# EAGLE design UP-4_v9 (EAGLE 6.4)
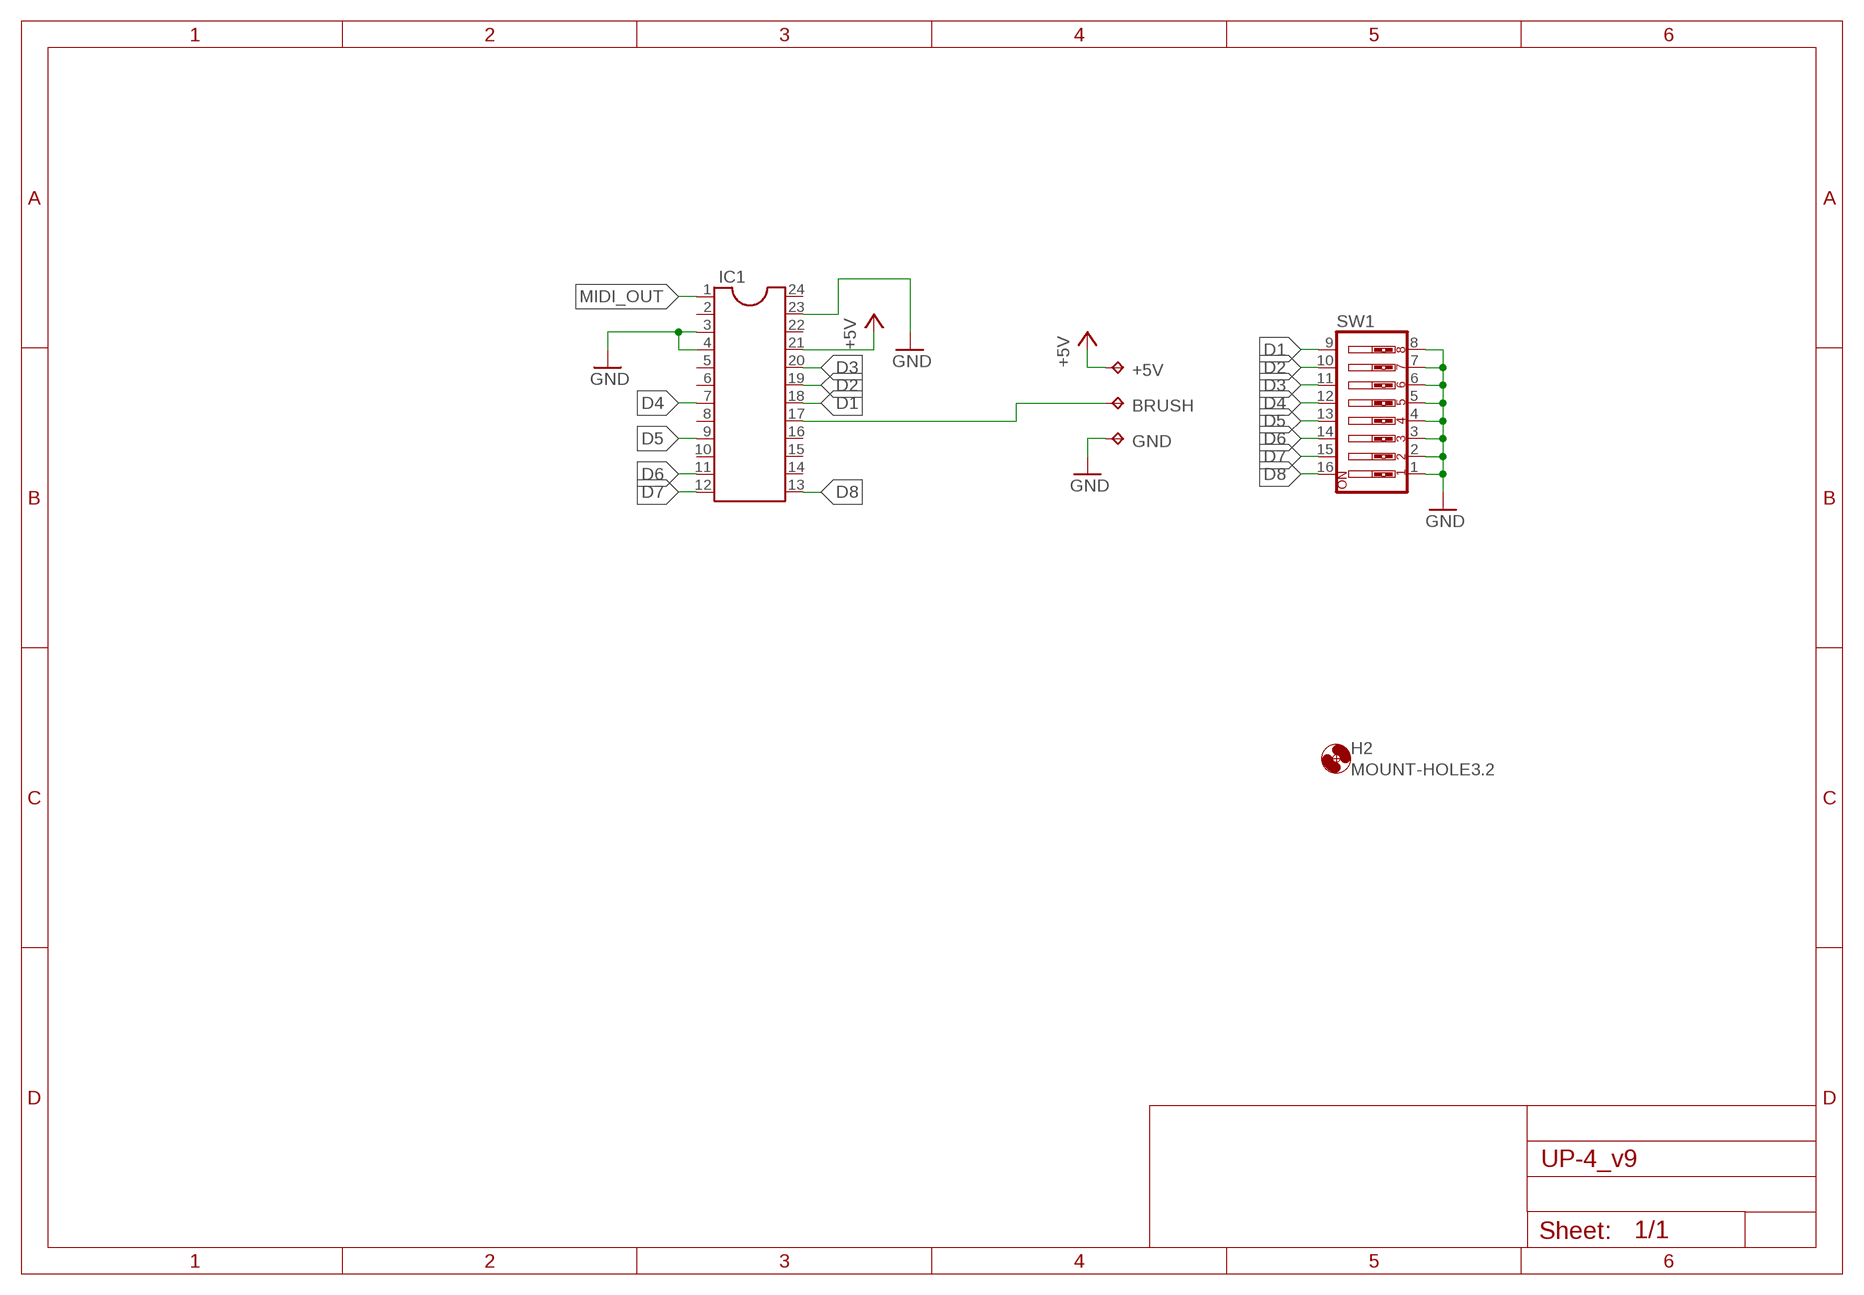
[diagram p0: schematic, sheet 1]

## Parts
+5V  TPB2,54  [B2,54]
BRUSH  TPB2,54  [B2,54]
GND  TPB2,54  [B2,54]
H2  MOUNT-HOLE3.2  [3,2]
IC1  DIL24-6  [DIL24-6]
SW1  SW_DIP-8  [EDG-08]

## Nets
+5V: +5V.TP IC1.21
BRUSH: BRUSH.TP IC1.17
D1: IC1.18 SW1.9
D2: IC1.19 SW1.10
D3: IC1.20 SW1.11
D4: IC1.7 SW1.12
D5: IC1.9 SW1.13
D6: IC1.11 SW1.14
D7: IC1.12 SW1.15
D8: IC1.13 SW1.16
GND: GND.TP IC1.3 IC1.4 IC1.23 SW1.1 SW1.2 SW1.3 SW1.4 SW1.5 SW1.6 SW1.7 SW1.8
MIDI_OUT: IC1.1
Unconnected: IC1.2 IC1.5 IC1.6 IC1.8 IC1.10 IC1.14 IC1.15 IC1.16 IC1.22 IC1.24

## Library data of the parts
+5V BRUSH GND = testpad:TP: Test pad
H2 = holes:MOUNT-HOLE: MOUNTING HOLE with drill center marker
IC1 = ic-package:DIL24: Dual In Line
SW1 = special:SW_DIP-8: DIP SWITCH

## Board
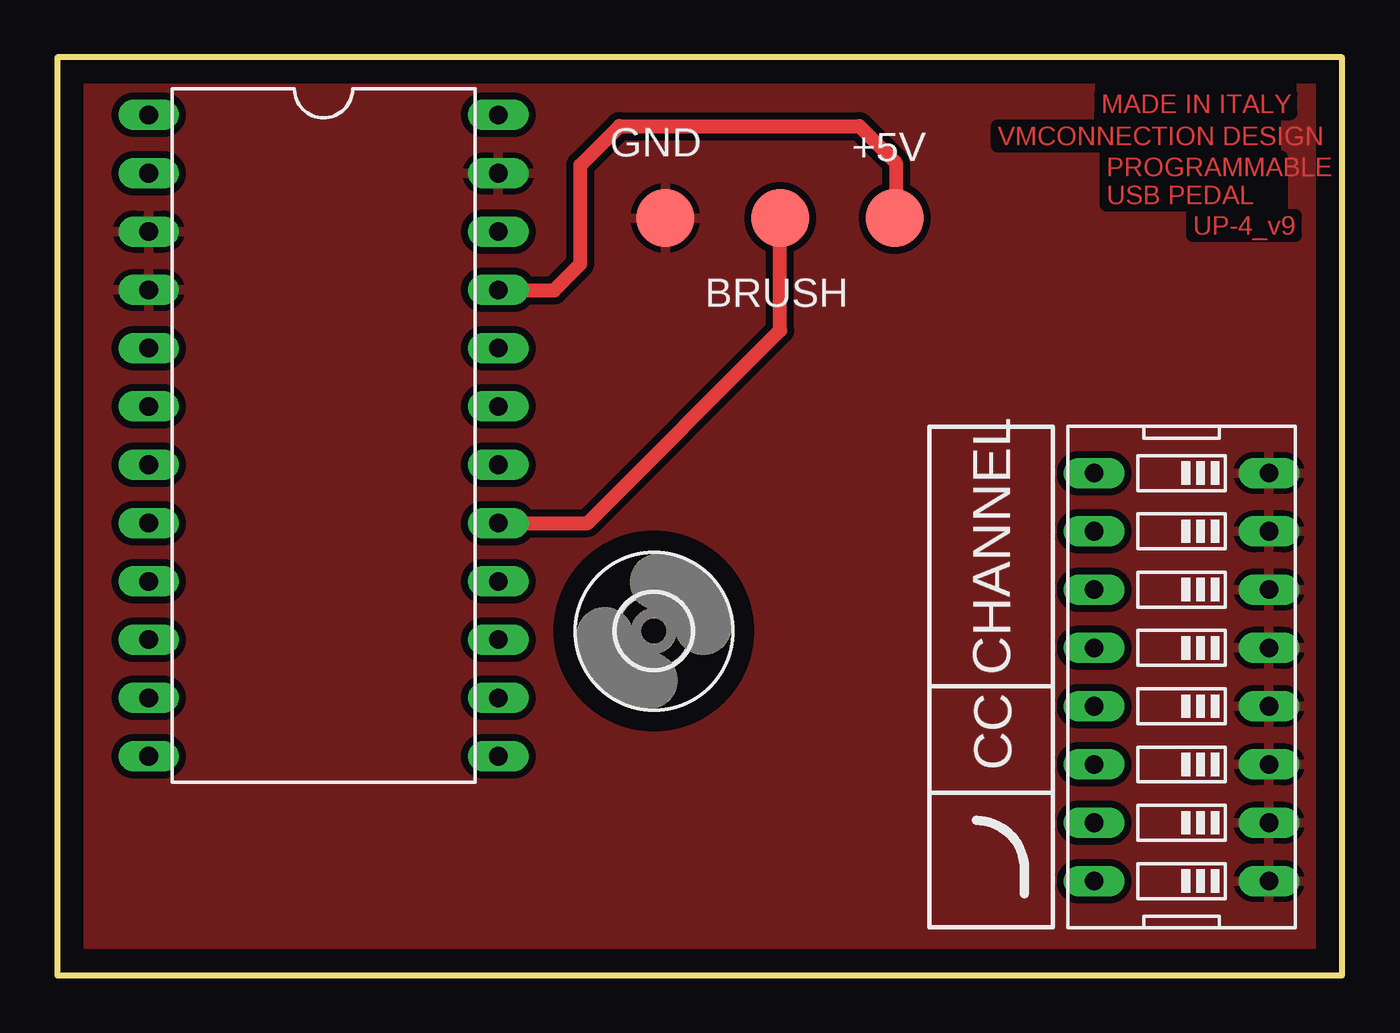
[diagram p1: board, top side]
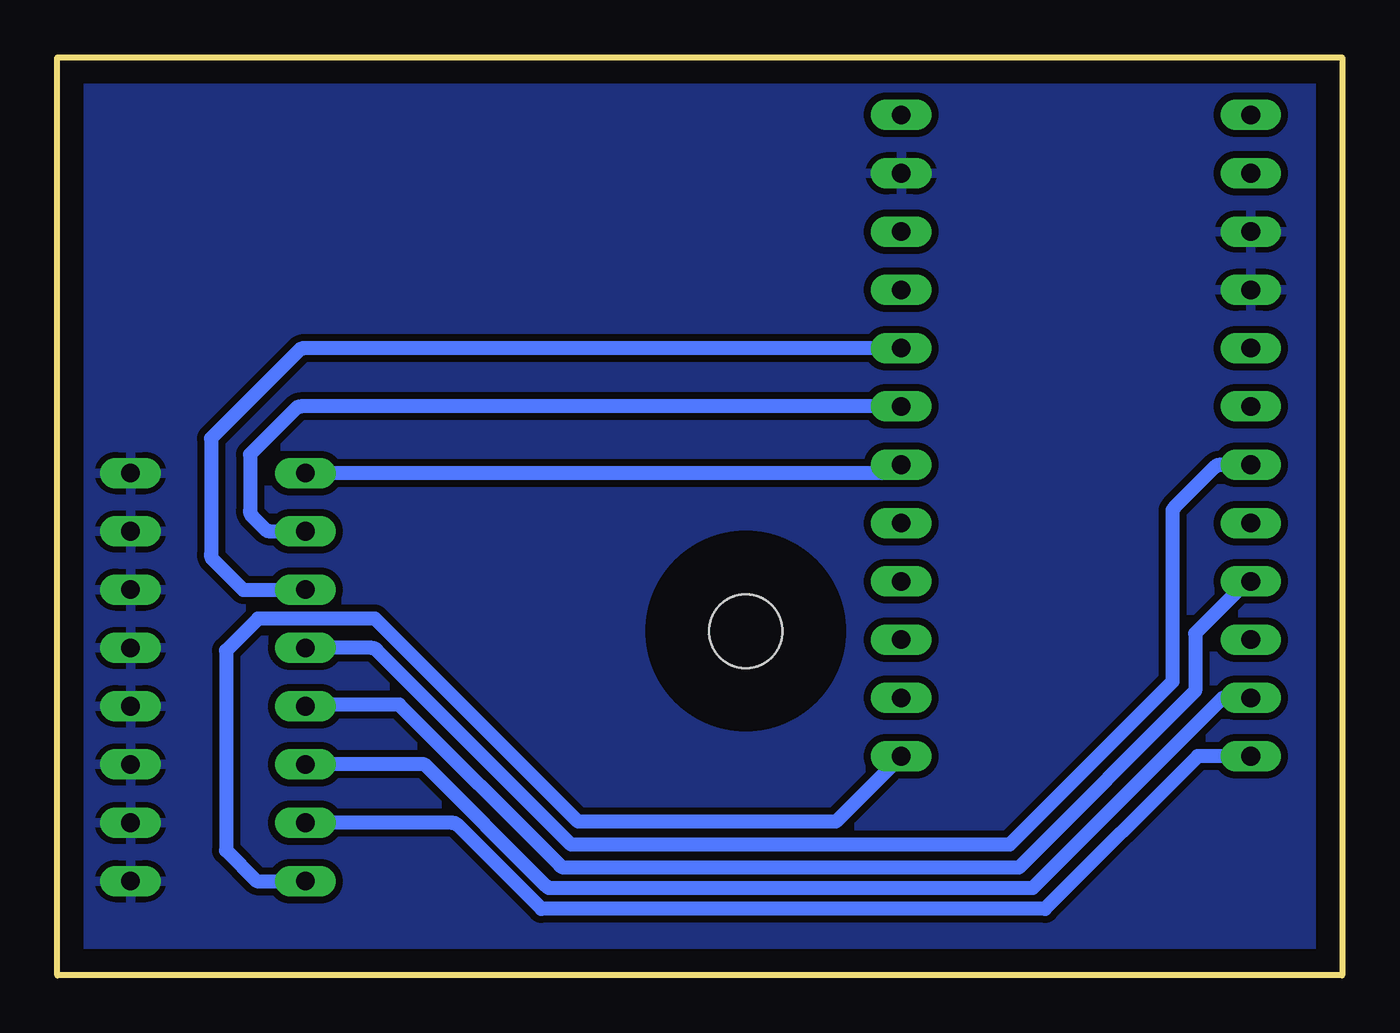
[diagram p2: board, bottom side, seen from below]

Size 56 x 40 mm. Coordinates in mm from the lower left corner, seen from the top.
Outline: 56,0 56,40 0,40 0,0 56,0
Copper layers (1*16): Top 0.035mm / dielectric 1.5mm / Bottom 0.035mm
Design rules "default": minimum track width 10mil, minimum drill 24mil, track to track 8mil, track to pad 8mil, pad to pad 8mil, via to via 8mil, smd to smd 8mil, copper to edge 40mil, drill to drill 8mil, minimum pad ring 10mil, minimum via ring 8mil, stop-mask expansion 4mil, vias tented up to drill 0mil, thermal gap 10mil

### Footprints (pad centres in the part's own frame; a part is rotated, then mirrored left to right if it is on the bottom)
B2,54 = smd 2.54 x 2.54: TP 0,0
3,2 = hole 3.2: 0,0
DIL24-6 = drill 0.813 long: 1 -13.97,-7.62; 2 -11.43,-7.62; 3 -8.89,-7.62; 4 -6.35,-7.62; 5 -3.81,-7.62; 6 -1.27,-7.62; 7 1.27,-7.62; 8 3.81,-7.62; 9 6.35,-7.62; 10 8.89,-7.62; 11 11.43,-7.62; 12 13.97,-7.62; 13 13.97,7.62; 14 11.43,7.62; 15 8.89,7.62; 16 6.35,7.62; 17 3.81,7.62; 18 1.27,7.62; 19 -1.27,7.62; 20 -3.81,7.62; 21 -6.35,7.62; 22 -8.89,7.62; 23 -11.43,7.62; 24 -13.97,7.62
EDG-08 = drill 0.813 long: 1 -8.89,-3.81; 2 -6.35,-3.81; 3 -3.81,-3.81; 4 -1.27,-3.81; 5 1.27,-3.81; 6 3.81,-3.81; 7 6.35,-3.81; 8 8.89,-3.81; 9 8.89,3.81; 10 6.35,3.81; 11 3.81,3.81; 12 1.27,3.81; 13 -1.27,3.81; 14 -3.81,3.81; 15 -6.35,3.81; 16 -8.89,3.81

### Placement (x,y rotation side)
+5V  36.5,33 90 top
BRUSH  31.5,33 90 top
GND  26.5,33 90 top
H2  26,15 0 top
IC1  11.6,23.52 270 top
SW1  49,13 90 top

### Tracks (layer width: path | path; a pad name or v marks a point on that pad's centre or on a via)
+5V
  Top 0.61: IC1.21 19.24,29.85 21.65,29.85 22.8,31 22.8,35.3 24.5,37 34.95,37 36.55,35.4 36.55,33.05 +5V.TP
BRUSH
  Top 0.61: IC1.17 23.11,19.71 31.5,28.1 BRUSH.TP
D1
  Bottom 0.61: IC1.18 19.49,21.98 arc45 19.71,21.89 SW1.9
D2
  Bottom 0.61: IC1.19 45.38,24.79 arc-45 45.6,24.7 47.6,22.7 47.6,20.23 arc-45 47.51,20.01 46.94,19.44 arc-45 46.72,19.35 SW1.10
D3
  Bottom 0.61: IC1.20 45.24,27.33 arc-45 45.46,27.24 49.3,23.4 49.3,18.33 arc-45 49.21,18.11 47.9,16.8 45.21,16.8 arc-45 SW1.11
D4
  Bottom 0.61: IC1.7 5.32,22.25 arc-45 5.54,22.16 7.31,20.39 arc-45 7.4,20.17 7.4,12.8 14.5,5.7 33.6,5.7 42.08,14.18 arc-45 42.3,14.27 SW1.12
D5
  Bottom 0.61: IC1.9 4,17.17 arc-45 4.22,17.08 6.4,14.9 6.4,12.4 14.1,4.7 33.87,4.7 arc45 34.09,4.79 41.1,11.8 45.02,11.8 arc-45 SW1.13
D6
  Bottom 0.61: SW1.14 arc45 45.17,9.2 40,9.2 34.69,3.89 arc-45 34.47,3.8 13.5,3.8 5.21,12.09 IC1.11
D7
  Bottom 0.61: SW1.15 38.78,6.65 arc45 38.56,6.56 34.9,2.9 12.95,2.9 6.3,9.55 IC1.12
D8
  Bottom 0.61: IC1.13 22.07,6.7 33.3,6.7 42.15,15.55 47.25,15.55 48.65,14.15 48.65,5.45 47.31,4.11 SW1.16
GND
  pour Top (isolate 0.305): 0,-0.02 56,-0.02 56,40 0,40
  pour Bottom (isolate 0.305): 0,-0.02 56,-0.02 56,40 0,40

### Text on the board
Top: MADE IN ITALY | VMCONNECTION DESIGN | PROGRAMMABLE / USB PEDAL | UP-4_v9
tPlace: CHANNEL | CC